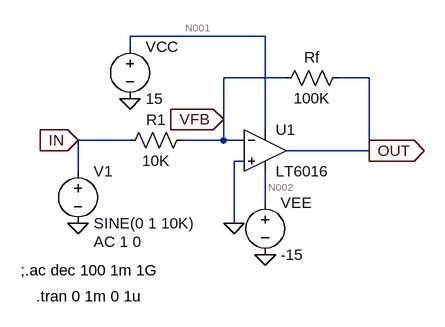
[diagram p0: schematic inverting.asc]
* inverting.asc
* U1: LT6016 (symbol OpAmps\LT6016 not available, pins judged from their places): In+=0 In-=VFB V+=N001 V-=N002 OUT=OUT
VCC N001 0 15
VEE N002 0 -15
R1 VFB IN 10K
Rf OUT VFB 100K
V1 IN 0 SINE(0 1 10K) AC 1 0
;.ac dec 100 1m 1G
.tran 0 1m 0 1u
.backanno
.end

* Results of the author's LTspice run, read from the files saved beside the schematic
* Operating Point, zero values left out:
*   V(n002) = -15 V
*   V(n001) = 15 V
*   V(out) = 176.5 µV
*   V(vfb) = -20.2 nV
*   I(Rf) = 1.765 nA
*   I(R1) = -2.02 pA
*   I(V1) = -2.02 pA
*   I(Vee) = 345.9 µA
*   I(Vcc) = -345.9 µA
*   Ix(u1:1) = 1.767 nA
*   Ix(u1:2) = 1.767 nA
*   Ix(u1:3) = 345.9 µA
*   Ix(u1:4) = -345.9 µA
*   Ix(u1:5) = -1.751 nA
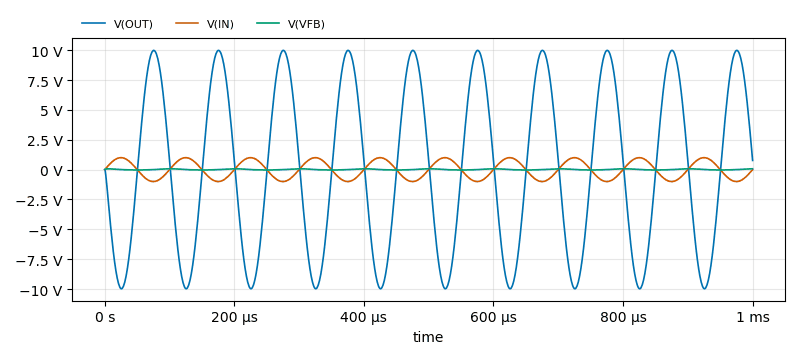
[diagram p1: Transient Analysis of inverting.asc, plotted from the saved traces]
* Transient Analysis, 1 run:
*   V(OUT): min -9.983 V, max 9.989 V, average 118.4 mV, rms 7.056 V, last 767.7 mV
*   V(IN): min -1 V, max 1 V, average 4.104 µV, rms 707.2 mV, last 0 V
*   V(VFB): min -31.31 mV, max 70.1 mV, average 10.75 mV, rms 36.51 mV, last 69.65 mV